# Altium schematic sheet OpAmp.schdoc: Analog Amplifier
size A4; Organization: Altium Limited; Address1: L3, 12a Rodborough Rd; Address2: Frenchs Forest; Address3: NSW; Address4: Australia 2086; DocumentNumber: 1; SheetNumber: 1; SheetTotal: 1
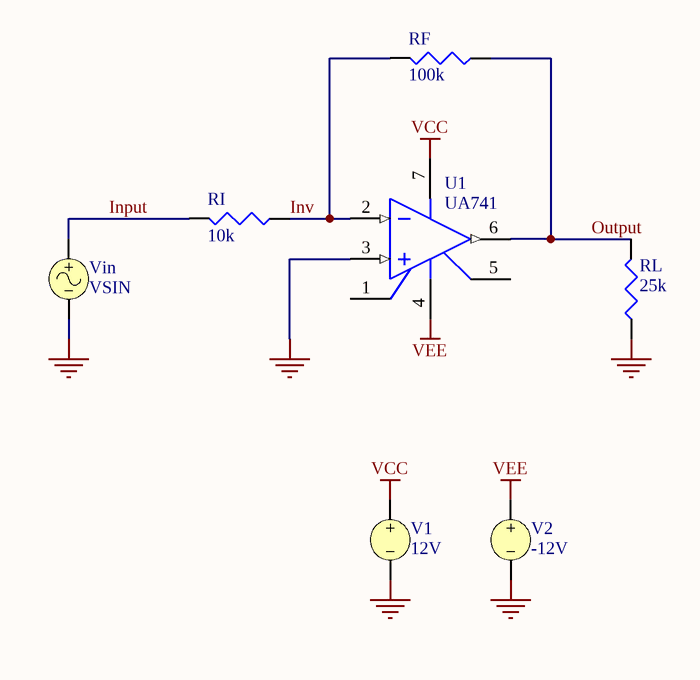
[diagram p0: OpAmp.schdoc]

## Parts
RF  100k
RI  10k
RL  25k
U1  UA741
V1  12V
V2  -12V
Vin  VSIN

## Nets
GND: RL.2(BOT) U1.3(+IN) V1.2 V2.2 Vin.2
VCC: U1.7(V+) V1.1
VEE: U1.4(V-) V2.1
Input: RI.1(TOP) Vin.1
Inv: RF.1(TOP) RI.2(BOT) U1.2(-IN)
Output: RF.2(BOT) RL.1(TOP) U1.6(OUT)

Not connected (* = marked no-connect by the designer): U1 1(OFFSET_NULL_1) 5(OFFSET_NULL_2)

## Notes on the sheet
- Title
- Size:
- Date:
- A4
- Number:
- Time:
- Revision:
- Sheet
- of
- File:

## Library data of the parts
RF RI RL = RES: Resistor
  RF: Value: 100k
  RI: Value: 10k
  RL: Value: 25k
U1 = UA741: General-Purpose Operational Amplifier; DeviceFunction: Amplifier
V1 V2 = VSRC: Voltage Source
  V1: Value: 12V
  V2: Value: -12V
Vin = VSIN: Sinusoidal Voltage Source